# EasyEDA Pro project Custom_Stm_Board_v1.1.epro

# Schematic Schematic1
Board Name: Board1; Create Date: 2026-06-29; Page Name: P1; Project Name: Custom_stm_board; Schematic Name: Schematic1; Update Date: 2026-06-29; Company: EasyEDA.com; Page Size: A4; Version: V1.0
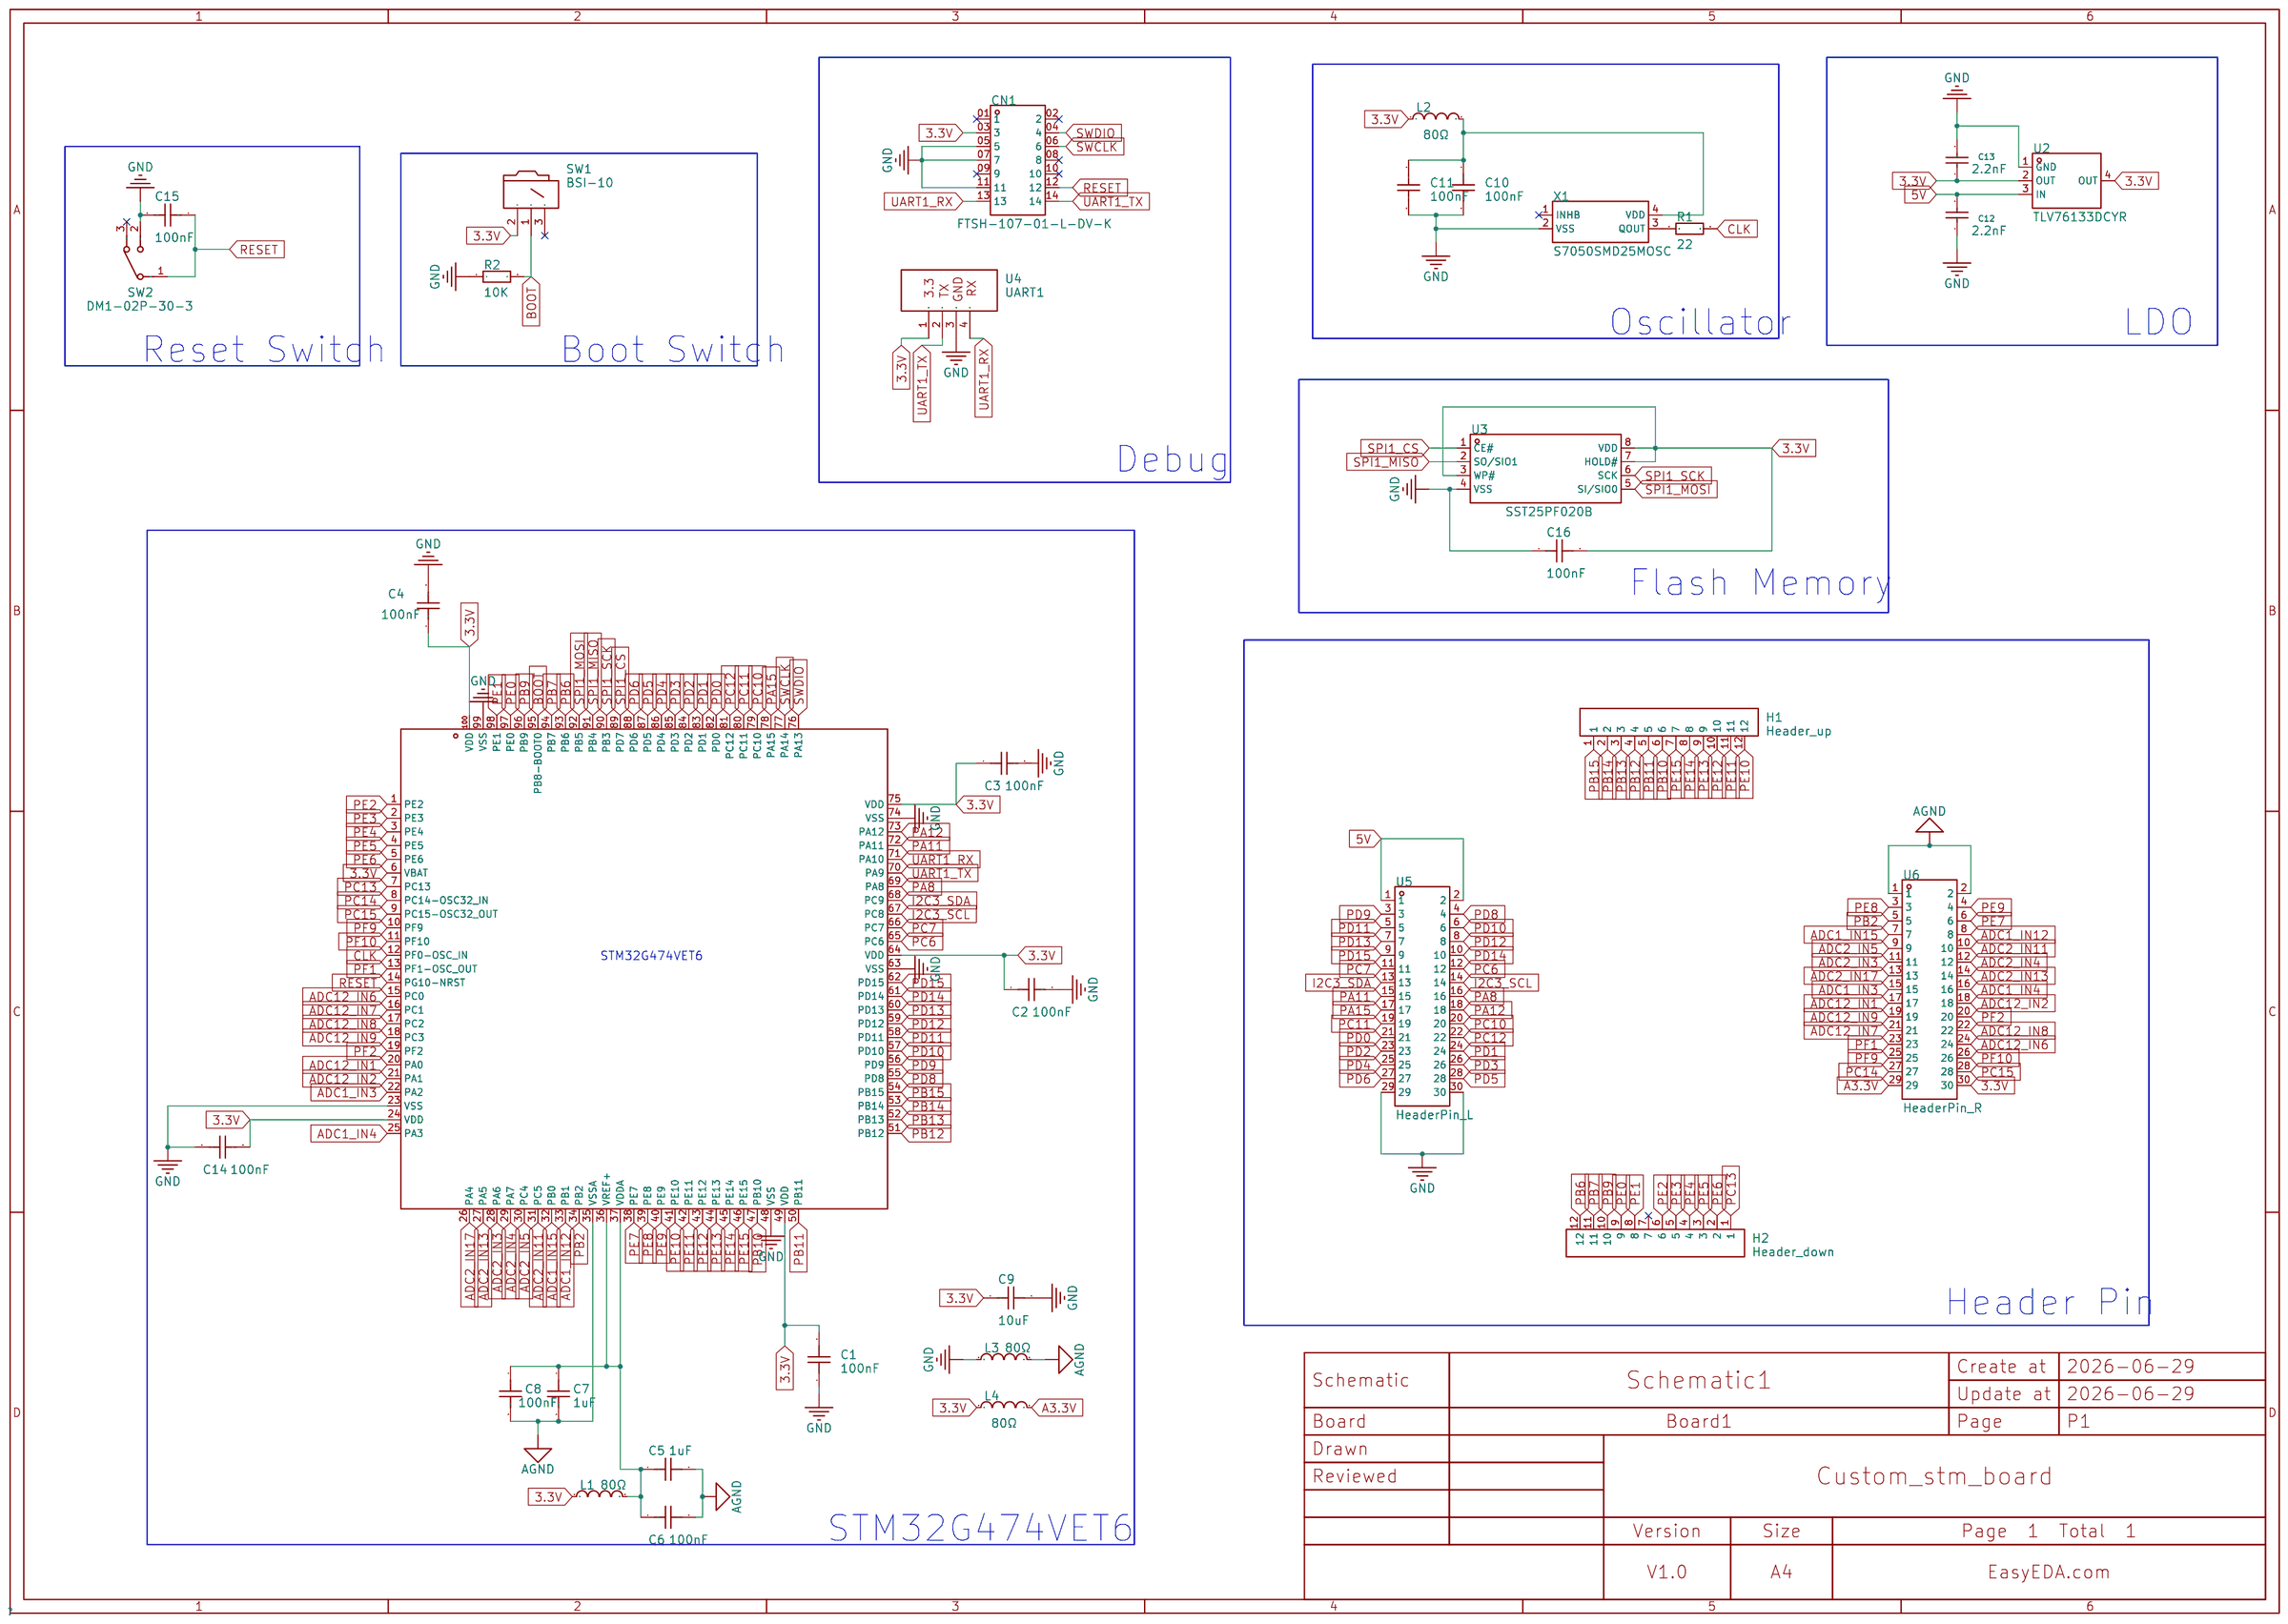
[diagram p0: schematic sheet]

## Parts
C1  100nF  [C0603]
C2  100nF  [C0603]
C3  100nF  [C0603]
C4  100nF  [C0603]
C5  1uF  [C0603]
C6  100nF  [C0603]
C7  1uF  [C0603]
C8  100nF  [C0603]
C9  10uF  [C0603]
C10  100nF  [C0603]
C11  100nF  [C0603]
C12  2.2nF  [C0805]
C13  2.2nF  [C0805]
C14  100nF  [C0603]
C15  100nF  [C0603]
C16  100nF  [C0603]
CN1  FTSH-107-01-L-DV-K  [HDR-SMD_14P-P1.27_FTSH-107-01-L-DV-K]
H1  Header_up  [HDR-TH_12P-P2.54-V-M]
H2  Header_down  [HDR-TH_12P-P2.54-V-M]
L1  80Ω  [L0603]
L2  80Ω  [L0603]
L3  80Ω  [L0603]
L4  80Ω  [L0603]
R1  22  [R0603]
R2  10K  [R0603]
SW1  BSI-10  [SW-TH_BSI-10]
SW2  DM1-02P-30-3  [SW-TH_3P-L12.8-W5.8-P5.08_DM1-02P-30-3]
U1  STM32G474VET6  [LQFP-100_L14.0-W14.0-P0.50-LS16.0-BL]
U2  TLV76133DCYR  [SOT-223-4_L6.5-W3.5-P2.30-LS7.0-TR]
U3  SST25PF020B  [SOIC-8_L4.9-W3.9-P1.27-LS6.0-BL]
U4  UART１  [DC_Main_to_Motordriver_Connector_L]
U5  HeaderPin_L  [HDR-TH_30P-P2.54-V-M-R2-C15-S2.54-BL]
U6  HeaderPin_R  [HDR-TH_30P-P2.54-V-M-R2-C15-S2.54-BL]
X1  S7050SMD25MOSC  [OSC-SMD_4P-L7.0-W5.0-BL-2]

## Library data of the parts
C1-C11 C14-C16 = CAP_0603: Supplier Footprint: 0603
C12 C13 = CL21B474KBFNNNE: Capacitance: Tolerance:±10% Tolerance:±10% Voltage Rated: Temperature Coefficient:; LCSC Part Name: 470nF ±10% 50V; Supplier Part: C13967; Manufacturer: SAMSUNG(三星); Supplier Footprint: 0805; JLCPCB Part Class: Basic Part; Datasheet: https://atta.szlcsc.com/upload/public/pdf/source/20160218/1457707763339.pdf; Supplier: LCSC; Tolerance: ±10%
CN1 = FTSH-107-01-L-DV-K: Pin Structure:2x7P Pitch:1.27mm Circluar Pins/Square Pins:Pin Header Mounting Type:Surface Mount,Vertical Number of Rows:2 Number of Pins:14P Length of Mating Pin:3.05mm Contact Material:Phosphor Bronze Contact Plating:Gold Operating Temperature:-55℃~+125; LCSC Part Name: 2x7P 间距:1.27mm 方针 立贴; Supplier Part: C5307809; Manufacturer: SAMTEC; Supplier Footprint: SMD,P=1.27mm; JLCPCB Part Class: Extended Part; Datasheet: https://item.szlcsc.com/datasheet/FTSH-107-01-L-DV-K/6061160.html; Supplier: LCSC; Pin Structure: 2x7P; Pitch: 1.27mm; Circluar Pins/Square Pins: Pin Header; Mounting Type: Surface Mount,Vertical; Number of Rows: 2; Number of Pins: 14P; Length of Mating Pin: 3.05mm; Contact Material: Phosphor Bronze; Contact Plating: Gold; Operating Temperature: -55℃~+125℃; Color: Black
H1 H2 = PZ254V-11-12P: Pin Structure:1x12P Pitch:2.54mm Row Spacing:- Circluar Pins/Square Pins:Pin Header Mounting Type:Through Hole Number of Rows:1 Number of Pins:12P Current Rating:3A Voltage Rating (Max):250V Length of Mating Pin:6mm Insulation Height:2.5mm Length of End C; LCSC Part Name: 1x12P 间距:2.54mm 方针 直插; Supplier Part: C2840012; Manufacturer: XFCN(兴飞); Supplier Footprint: 插件,P=2.54mm; JLCPCB Part Class: Extended Part; Datasheet: https://item.szlcsc.com/datasheet/PZ254V-11-12P/3017606.html; Supplier: LCSC; Pin Structure: 1x12P; Pitch: 2.54mm; Circluar Pins/Square Pins: Pin Header; Mounting Type: Through Hole; Number of Rows: 1; Number of Pins: 12P; Current Rating: 3A; Voltage Rating (Max): 250V; Length of Mating Pin: 6mm; Insulation Height: 2.5mm; Length of End Connection Pin: 3mm; Operating Temperature: -40℃~+105℃; Color: Black
L1 L3 = GZ1608D601TF: Impedance @ Frequency:600Ω@100MHz Tolerance:±25% Tolerance:±25% DC Resistance(DCR):450mΩ Current Rating:200mA Number of Circuits:1 Operating Temperature:-55℃~+125℃ Operating Temperature:-55℃~+125℃; LCSC Part Name: 单路 0603磁珠 阻抗600Ω@100MHz; Supplier Part: C1002; Manufacturer: Sunlord(顺络); Supplier Footprint: 0603; JLCPCB Part Class: Basic Part; Datasheet: https://item.szlcsc.com/datasheet/GZ1608D601TF/1354.html; Supplier: LCSC; Impedance @ Frequency: 600Ω@100MHz; Tolerance: ±25%; DC Resistance(DCR): 450mΩ; Current Rating: 200mA; Number of Circuits: 1; Operating Temperature: -55℃~+125℃
L2 L4 = L_0603
R1 R2 = Res_0603: Supplier Footprint: 0603
SW1 = BSI-10: Circuit:SPDT Actuator Style:- Termination Style:PC Pin Length:10mm Width:2.5mm Switch Height:6.4mm Mounting Type:Through Hole Actuator Color:Red Current Rating:500mA Voltage Rating:12V Life:1,000 Cycles Operating Temperature:-40℃~+85℃ Operating Temperatur; LCSC Part Name: 滑动开关; Supplier Part: C2985934; Manufacturer: SM Switch; Supplier Footprint: 插件,10x2.5mm; JLCPCB Part Class: Extended Part; Datasheet: https://item.szlcsc.com/datasheet/BSI-10/3431186.html; Supplier: LCSC; Circuit: SPDT; Termination Style: PC Pin; Length: 10mm; Width: 2.5mm; Switch Height: 6.4mm; Mounting Type: Through Hole; Actuator Color: Red; Current Rating: 500mA; Voltage Rating: 12V; Life: 1,000 Cycles; Operating Temperature: -40℃~+85℃
SW2 = DM1-02P-30-3: Circuit:SPDT Actuator Style:- Length:12.8mm Width:5.8mm Switch Height:6.7mm Current Rating (DC):50mA Voltage Rating (DC):125V Current Rating (AC):1A Voltage Rating (AC):125V Life:50,000 cycles Termination Style:PC Pin Operating Temperature:-25℃~+85℃ Opera; LCSC Part Name: 鼠标3脚微动 白点直柄13.5; Supplier Part: C431538; Manufacturer: SHOU HAN(首韩); Supplier Footprint: 插件,12.8x6.4mm; JLCPCB Part Class: Extended Part; Datasheet: https://item.szlcsc.com/datasheet/DM1-02P-30-3/427895.html; Supplier: LCSC; Circuit: SPDT; Length: 12.8mm; Width: 5.8mm; Switch Height: 6.7mm; Current Rating (DC): 50mA; Voltage Rating (DC): 125V; Current Rating (AC): 1A; Voltage Rating (AC): 125V; Life: 50,000 cycles; Termination Style: PC Pin; Operating Temperature: -25℃~+85℃
U1 = STM32G474VET6: CPU Core:ARM Cortex-M Series CPU Maximum Speed:170MHz Program Storage Size:512KB Program Memory Type:FLASH Number of I/O:86 ADC (Bit):12bit DAC (Bit):12bit Voltage - Supply:1.71V~3.6V Voltage - Supply:1.71V~3.6V Applications:-; LCSC Part Name: 带DSP和FPU的170MHz主流ARM Cortex-M4 MCU，具有512 KB Flash存储器、数学加速器、高分辨率定时器和高模拟电平集成; Supplier Part: C431632; Manufacturer: ST(意法半导体); Supplier Footprint: LQFP-100(14x14); JLCPCB Part Class: Extended Part; Datasheet: https://item.szlcsc.com/datasheet/STM32G474VET6/428110.html; Supplier: LCSC; CPU Core: ARM Cortex-M Series; CPU Maximum Speed: 170MHz; Program Storage Size: 512KB; Program Memory Type: FLASH; Number of I/O: 86; ADC (Bit): 12bit; DAC (Bit): 12bit; Voltage - Supply: 1.71V~3.6V
U2 = TLV76133DCYR: Output Type:Fixed Voltage - Supply:16V Output Voltage:3.3V Output Voltage:3.3V Output Current:1A Power Supply Rejection Ratio (PSRR):- standby current:- Noise:- Features:ESD Protection；Surge Protection；Low ESR；Over Temperature Protection；Under Voltage Loc; LCSC Part Name: 16V 1A 固定输出线性电压调节器; Supplier Part: C7527500; Manufacturer: TI(德州仪器); Supplier Footprint: SOT-223; JLCPCB Part Class: Extended Part; Datasheet: https://www.ti.com.cn/cn/lit/ds/symlink/tlv761.pdf?ts=1739383123903; Supplier: LCSC; Output Type: Fixed; Voltage - Supply: 16V; Output Voltage: 3.3V; Output Current: 1A; Features: ESD Protection；Surge Protection；Low ESR；Over Temperature Protection；Under Voltage Lockout；Over Current Protection；Enable；Reverse Current Protection; Operating Temperature: -40℃~+125℃@(Tj); Output Configuration: Positive; Number of Outputs: 1
U3 = SST25PF020B-80-4C-SAE-T: Interface Type:SPI Memory Size:2Mbit Clock Frequency (fc):80MHz Supply Voltage:2.3V~3.6V Supply Voltage:2.3V~3.6V Block Erase Time (tBE):18ms Data Retention - TDR (Year):100 years Operating Temperature:0℃~+70℃ Operating Temperature:0℃~+70℃; Supplier Part: C624745; Manufacturer: MICROCHIP(美国微芯); Supplier Footprint: SOIC-8; JLCPCB Part Class: Extended Part; Datasheet: https://atta.szlcsc.com/upload/public/pdf/source/20220621/33E3ED5F936835370EA58ECD5113757F.pdf; Supplier: LCSC; Interface Type: SPI; Memory Size: 2Mbit; Clock Frequency (fc): 80MHz; Supply Voltage: 2.3V~3.6V; Block Erase Time (tBE): 18ms; Data Retention - TDR (Year): 100 years; Operating Temperature: 0℃~+70℃
U4 = DC_Main_to_Motordriver_Connector
U5 U6 = PZ254V-12-30P: Pin Structure:2x15P Pitch:2.54mm Row Spacing:2.54mm Circluar Pins/Square Pins:Pin Header Mounting Type:Through Hole Number of Rows:2 Number of Pins:30P Current Rating:3A Length of Mating Pin:6.1mm Insulation Height:2.5mm Length of End Connection Pin:3mm C; LCSC Part Name: 2x15P 间距:2.54mm 方针 直插; Supplier Part: C22465939; Manufacturer: XFCN(兴飞); Supplier Footprint: 插件,P=2.54mm; JLCPCB Part Class: Extended Part; Datasheet: https://item.szlcsc.com/datasheet/PZ254V-12-30P/24163081.html; Supplier: LCSC; Pin Structure: 2x15P; Pitch: 2.54mm; Row Spacing: 2.54mm; Circluar Pins/Square Pins: Pin Header; Mounting Type: Through Hole; Number of Rows: 2; Number of Pins: 30P; Current Rating: 3A; Length of Mating Pin: 6.1mm; Insulation Height: 2.5mm; Length of End Connection Pin: 3mm; Contact Material: Brass; Operating Temperature: -40℃~+105℃; Color: Black
X1 = S7050SMD25MOSC: LCSC Part Name: 25MHz ±20ppm 1.8~5.0V; Supplier Part: C7431193; Manufacturer: SST(索斯特); Supplier Footprint: SMD7050-4P; Datasheet: https://item.szlcsc.com/datasheet/S7050SMD25MOSC/8432061.html; Supplier: LCSC

## Nets
3.3V: C1.2 C2.1 C3.1 C4.1 C9.1 C13.1 C14.2 C16.2 CN1.03(3) L1.1 L2.1 L4.1 SW1.2 U1.6(VBAT) U1.24(VDD) U1.49(VDD) U1.64(VDD) U1.75(VDD) U1.100(VDD) U2.2(OUT) U2.4(OUT) U3.3(WP#) U3.7(HOLD#) U3.8(VDD) U4.1 U6.30
5V: C12.2 U2.3(IN) U5.1 U5.2
A3.3V: L4.2 U6.29
AGND: C5.2 C6.2 C7.2 C8.2 L3.2 U1.35(VSSA) U6.1 U6.2
GND: C1.1 C2.2 C3.2 C4.2 C9.2 C10.2 C11.2 C12.1 C13.2 C14.1 C15.2 C16.1 CN1.05(5) CN1.07(7) CN1.11 L3.1 R2.1 SW2.2(ON) U1.23(VSS) U1.48(VSS) U1.63(VSS) U1.74(VSS) U1.99(VSS) U2.1(GND) U3.4(VSS) U4.3 U5.29 U5.30 X1.2(VSS)
ADC1_IN3: U1.22(PA2) U6.15
ADC1_IN4: U1.25(PA3) U6.16
ADC1_IN12: U1.33(PB1) U6.8
ADC1_IN15: U1.32(PB0) U6.7
ADC2_IN3: U1.28(PA6) U6.11
ADC2_IN4: U1.29(PA7) U6.12
ADC2_IN5: U1.30(PC4) U6.9
ADC2_IN11: U1.31(PC5) U6.10
ADC2_IN13: U1.27(PA5) U6.14
ADC2_IN17: U1.26(PA4) U6.13
ADC12_IN1: U1.20(PA0) U6.17
ADC12_IN2: U1.21(PA1) U6.18
ADC12_IN6: U1.15(PC0) U6.24
ADC12_IN7: U1.16(PC1) U6.21
ADC12_IN8: U1.17(PC2) U6.22
ADC12_IN9: U1.18(PC3) U6.19
BOOT: R2.2 SW1.1 U1.95(PB8-BOOT0)
CLK: R1.2 U1.12(PF0-OSC_IN)
I2C3_SCL: U1.67(PC8) U5.14
I2C3_SDA: U1.68(PC9) U5.13
PA8: U1.69(PA8) U5.16
PA11: U1.72(PA11) U5.15
PA12: U1.73(PA12) U5.18
PA15: U1.78(PA15) U5.17
PB2: U1.34(PB2) U6.5
PB6: H2.12 U1.93(PB6)
PB7: H2.11 U1.94(PB7)
PB9: H2.10 U1.96(PB9)
PB10: H1.6 U1.47(PB10)
PB11: H1.5 U1.50(PB11)
PB12: H1.4 U1.51(PB12)
PB13: H1.3 U1.52(PB13)
PB14: H1.2 U1.53(PB14)
PB15: H1.1 U1.54(PB15)
PC6: U1.65(PC6) U5.12
PC7: U1.66(PC7) U5.11
PC10: U1.79(PC10) U5.20
PC11: U1.80(PC11) U5.19
PC12: U1.81(PC12) U5.22
PC13: H2.1 U1.7(PC13)
PC14: U1.8(PC14-OSC32_IN) U6.27
PC15: U1.9(PC15-OSC32_OUT) U6.28
PD0: U1.82(PD0) U5.21
PD1: U1.83(PD1) U5.24
PD2: U1.84(PD2) U5.23
PD3: U1.85(PD3) U5.26
PD4: U1.86(PD4) U5.25
PD5: U1.87(PD5) U5.28
PD6: U1.88(PD6) U5.27
PD8: U1.55(PD8) U5.4
PD9: U1.56(PD9) U5.3
PD10: U1.57(PD10) U5.6
PD11: U1.58(PD11) U5.5
PD12: U1.59(PD12) U5.8
PD13: U1.60(PD13) U5.7
PD14: U1.61(PD14) U5.10
PD15: U1.62(PD15) U5.9
PE0: H2.9 U1.97(PE0)
PE1: H2.8 U1.98(PE1)
PE2: H2.6 U1.1(PE2)
PE3: H2.5 U1.2(PE3)
PE4: H2.4 U1.3(PE4)
PE5: H2.3 U1.4(PE5)
PE6: H2.2 U1.5(PE6)
PE7: U1.38(PE7) U6.6
PE8: U1.39(PE8) U6.3
PE9: U1.40(PE9) U6.4
PE10: H1.12 U1.41(PE10)
PE11: H1.11 U1.42(PE11)
PE12: H1.10 U1.43(PE12)
PE13: H1.9 U1.44(PE13)
PE14: H1.8 U1.45(PE14)
PE15: H1.7 U1.46(PE15)
PF1: U1.13(PF1-OSC_OUT) U6.23
PF2: U1.19(PF2) U6.20
PF9: U1.10(PF9) U6.25
PF10: U1.11(PF10) U6.26
RESET: C15.1 CN1.12 SW2.1(COM) U1.14(PG10-NRST)
SPI1_CS: U1.89(PD7) U3.1(CE#)
SPI1_MISO: U1.91(PB4) U3.2(SO/SIO1)
SPI1_MOSI: U1.92(PB5) U3.5(SI/SIO0)
SPI1_SCK: U1.90(PB3) U3.6(SCK)
SWCLK: CN1.06(6) U1.77(PA14)
SWDIO: CN1.04(4) U1.76(PA13)
UART1_RX: CN1.13 U1.71(PA10) U4.4
UART1_TX: CN1.14 U1.70(PA9) U4.2
$1N21: C5.1 C6.1 C7.1 C8.1 L1.2 U1.36(VREF+) U1.37(VDDA)
$1N29: R1.1 X1.3(QOUT)
$1N30: C10.1 C11.1 L2.2 X1.4(VDD)

Not connected (* = marked no-connect by the designer): CN1 01(1)* 02(2)* 08(8)* 09(9)* 10*; H2 7*; SW1 3*; SW2 3(NC)*; X1 1(INHB)*

## Notes on the sheet
- Oscillator
- LDO
- Reset Switch
- Boot Switch
- Debug
- Flash Memory
- STM32G474VET6
- Header Pin
- STM32G474VET6

# Board PCB1
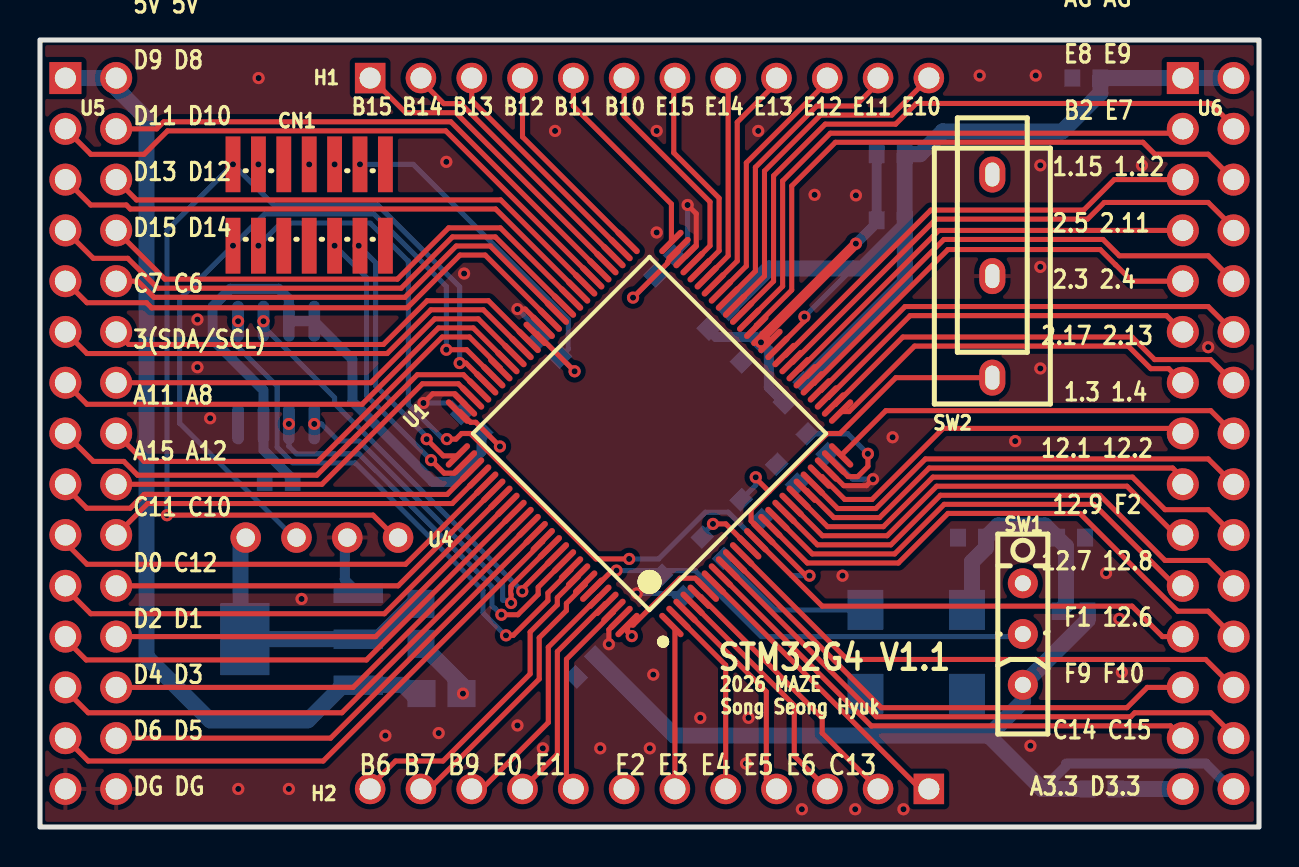
[diagram p1: board, top side]
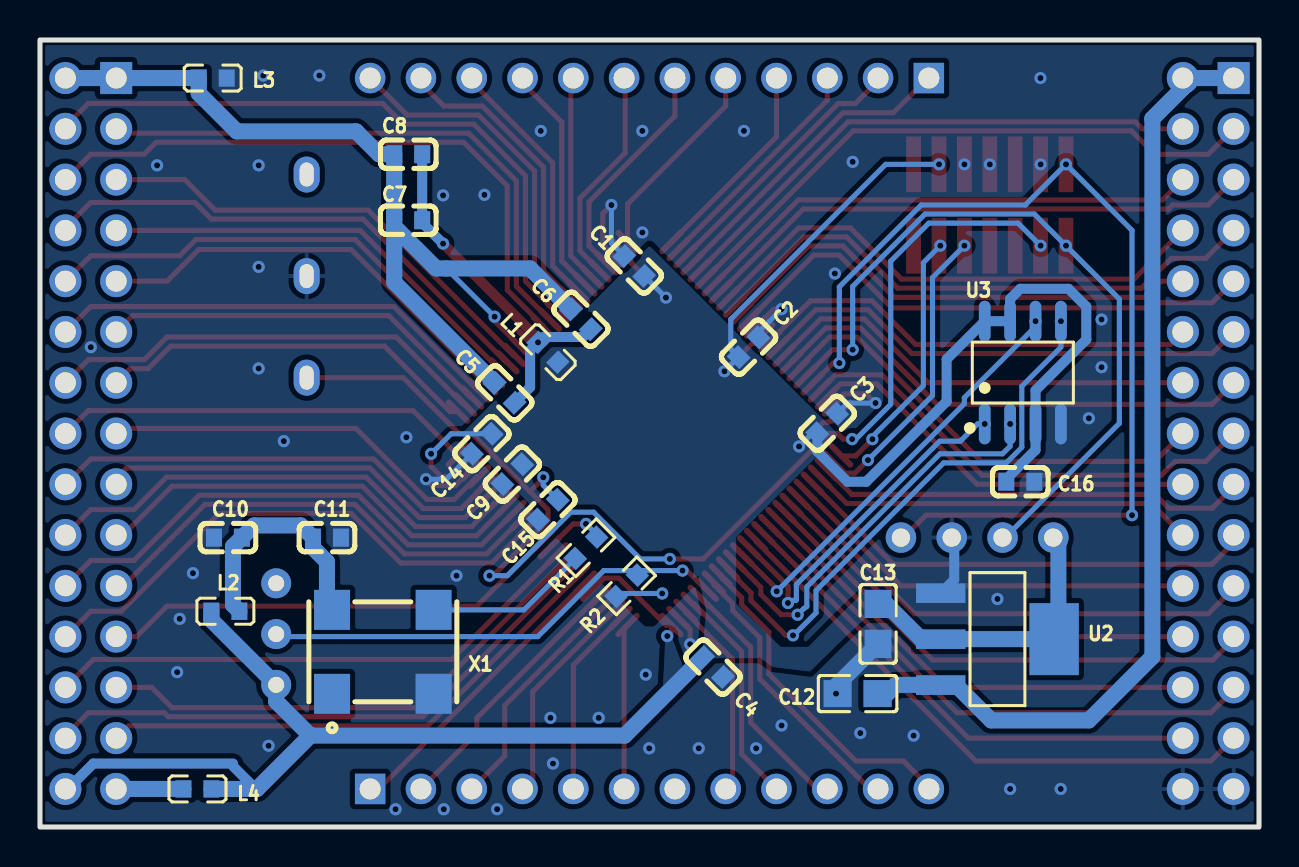
[diagram p2: board, bottom side, seen from below]

Outline 60.96 x 39.37 mm; copper layers: Top Layer, Bottom Layer. Coordinates in mm from the lower left corner of the outline.
Outline path: rectangle 0,39.37 60.96,0
Stack: Top Layer 0.035mm / Dielectric1 1.51mm FR4 er 4.5 / Bottom Layer 0.035mm

## Design rules (mm)
spacing copperThickness1oz (default): track to track 0.2, other pairs 0.152 to 0.3
spacing copperThickness2oz: track to track 0.203, other pairs 0.152 to 0.3
track width copperThickness1oz (default): min 0.127, default 0.254, max 2.54
track width copperThickness2oz: min 0.203, default 0.254, max 2.54
differential pair differentialPair (default): width min 0.127, default 0.254, max 2.54; gap min 0.152, default 0.152
net 3.3V uses copperRegion
net GND uses copperRegion

## Placement (name value [footprint] x y rotation side)
C1  100nF  [C0603]  31.24 28.07 225 bottom
C2  100nF  [C0603]  25.53 24 135 bottom
C3  100nF  [C0603]  21.59 20.19 135 bottom
C4  100nF  [C0603]  27.3 8 225 bottom
C5  1uF  [C0603]  37.72 21.72 45 bottom
C6  100nF  [C0603]  33.91 25.4 45 bottom
C7  1uF  [C0603]  42.55 30.35 0 bottom
C8  100nF  [C0603]  42.55 33.66 0 bottom
C9  10uF  [C0603]  37.34 17.65 315 bottom
C10  100nF  [C0603]  51.56 14.48 0 bottom
C11  100nF  [C0603]  46.61 14.48 180 bottom
C12  2.2nF  [C0805]  20.07 6.67 180 bottom
C13  2.2nF  [C0805]  19.05 10.16 270 bottom
C14  100nF  [C0603]  38.86 19.18 135 bottom
C15  100nF  [C0603]  35.56 15.88 315 bottom
C16  100nF  [C0603]  11.94 17.27 0 bottom
CN1  FTSH-107-01-L-DV-K  [HDR-SMD_14P-P1.27_FTSH-107-01-L-DV-K]  13.46 31.12 180 top
H1  Header_up  [HDR-TH_12P-P2.54-V-M]  30.48 37.47 0 top
H2  Header_down  [HDR-TH_12P-P2.54-V-M]  30.48 1.91 180 top
L1  80Ω  [L0603]  35.56 23.75 45 bottom
L2  80Ω  [L0603]  51.69 10.8 180 bottom
L3  80Ω  [L0603]  52.32 37.47 0 bottom
L4  80Ω  [L0603]  53.09 1.91 0 bottom
R1  22  [R0603]  33.66 13.97 135 bottom
R2  10K  [R0603]  31.62 12.06 135 bottom
SW1  BSI-10  [SW-TH_BSI-10]  49.15 9.65 90 top
SW2  DM1-02P-30-3  [SW-TH_3P-L12.8-W5.8-P5.08_DM1-02P-30-3]  47.63 27.56 90 top
U1  STM32G474VET6  [LQFP-100_L14.0-W14.0-P0.50-LS16.0-BL]  30.48 19.69 45 top
U2  TLV76133DCYR  [SOT-223-4_L6.5-W3.5-P2.30-LS7.0-TR]  13.08 9.4 270 bottom
U3  SST25PF020B  [SOIC-8_L4.9-W3.9-P1.27-LS6.0-BL]  11.81 22.73 180 bottom
U4  UART１  [DC_Main_to_Motordriver_Connector_L]  14.1 14.48 90 top
U5  HeaderPin_L  [HDR-TH_30P-P2.54-V-M-R2-C15-S2.54-BL]  2.54 19.69 270 top
U6  HeaderPin_R  [HDR-TH_30P-P2.54-V-M-R2-C15-S2.54-BL]  58.42 19.69 270 top
X1  S7050SMD25MOSC  [OSC-SMD_4P-L7.0-W5.0-BL-2]  43.82 8.76 180 bottom

## Footprints (pads in the part's own frame, mm; a bottom-side part is the same pattern mirrored in y, then rotated)
C0603
  rect 0.8x0.9 smd: 1(-0.7,0) 2(0.7,0)
C0805
  rect 1.41x1.35 smd: 1(-1,0) 2(1,0)
DC_Main_to_Motordriver_Connector_L
  round 1.524 hole 0.914: 0(0,3.81) 1(0,1.27) 2(0,-1.27) 3(0,-3.81)
HDR-SMD_14P-P1.27_FTSH-107-01-L-DV-K
  rect 0.74x2.79 smd: 01(-3.81,-2.035) 02(-3.81,2.035) 03(-2.54,-2.035) 04(-2.54,2.035) 05(-1.27,-2.035) 06(-1.27,2.035) 07(0,-2.035) 08(0,2.035) 09(1.27,-2.035) 10(1.27,2.035) 11(2.54,-2.035) 12(2.54,2.035) 13(3.81,-2.035) 14(3.81,2.035)
HDR-TH_12P-P2.54-V-M
  rect 1.524x1.524 hole 1.05: 1(-13.97,0)
  round 1.524 hole 1.05: 2(-11.43,0) 3(-8.89,0) 4(-6.35,0) 5(-3.81,0) 6(-1.27,0) 7(1.27,0) 8(3.81,0) 9(6.35,0) 10(8.89,0) 11(11.43,0) 12(13.97,0)
HDR-TH_30P-P2.54-V-M-R2-C15-S2.54-BL
  rect 1.6x1.6 hole 1.05: 1(-17.78,-1.27)
  round 1.6 hole 1.05: 2(-17.78,1.27) 3(-15.24,-1.27) 4(-15.24,1.27) 5(-12.7,-1.27) 6(-12.7,1.27) 7(-10.16,-1.27) 8(-10.16,1.27) 9(-7.62,-1.27) 10(-7.62,1.27) 11(-5.08,-1.27) 12(-5.08,1.27) 13(-2.54,-1.27) 14(-2.54,1.27) 15(0,-1.27) 16(0,1.27) 17(2.54,-1.27) 18(2.54,1.27) 19(5.08,-1.27) 20(5.08,1.27) 21(7.62,-1.27) 22(7.62,1.27) 23(10.16,-1.27) 24(10.16,1.27) 25(12.7,-1.27) 26(12.7,1.27) 27(15.24,-1.27) 28(15.24,1.27) 29(17.78,-1.27) 30(17.78,1.27)
L0603
  rect 0.8x0.864 smd: 1(-0.7,0) 2(0.7,0)
LQFP-100_L14.0-W14.0-P0.50-LS16.0-BL
  oval 0.3x1.6 smd: 1(-6,-7.55) 2(-5.5,-7.55) 3(-5,-7.55) 4(-4.5,-7.55) 5(-4,-7.55) 6(-3.5,-7.55) 7(-3,-7.55) 8(-2.5,-7.55) 9(-2,-7.55) 10(-1.5,-7.55) 11(-1,-7.55) 12(-0.5,-7.55) 13(0,-7.55) 14(0.5,-7.55) 15(1,-7.55) 16(1.5,-7.55) 17(2,-7.55) 18(2.5,-7.55) 19(3,-7.55) 20(3.5,-7.55) 21(4,-7.55) 22(4.5,-7.55) 23(5,-7.55) 24(5.5,-7.55) 25(6,-7.55) 51(6,7.55) 52(5.5,7.55) 53(5,7.55) 54(4.5,7.55) 55(4,7.55) 56(3.5,7.55) 57(3,7.55) 58(2.5,7.55) 59(2,7.55) 60(1.5,7.55) 61(1,7.55) 62(0.5,7.55) 63(0,7.55) 64(-0.5,7.55) 65(-1,7.55) 66(-1.5,7.55) 67(-2,7.55) 68(-2.5,7.55) 69(-3,7.55) 70(-3.5,7.55) 71(-4,7.55) 72(-4.5,7.55) 73(-5,7.55) 74(-5.5,7.55) 75(-6,7.55)
  oval 1.6x0.3 smd: 26(7.55,-6) 27(7.55,-5.5) 28(7.55,-5) 29(7.55,-4.5) 30(7.55,-4) 31(7.55,-3.5) 32(7.55,-3) 33(7.55,-2.5) 34(7.55,-2) 35(7.55,-1.5) 36(7.55,-1) 37(7.55,-0.5) 38(7.55,0) 39(7.55,0.5) 40(7.55,1) 41(7.55,1.5) 42(7.55,2) 43(7.55,2.5) 44(7.55,3) 45(7.55,3.5) 46(7.55,4) 47(7.55,4.5) 48(7.55,5) 49(7.55,5.5) 50(7.55,6) 76(-7.55,6) 77(-7.55,5.5) 78(-7.55,5) 79(-7.55,4.5) 80(-7.55,4) 81(-7.55,3.5) 82(-7.55,3) 83(-7.55,2.5) 84(-7.55,2) 85(-7.55,1.5) 86(-7.55,1) 87(-7.55,0.5) 88(-7.55,0) 89(-7.55,-0.5) 90(-7.55,-1) 91(-7.55,-1.5) 92(-7.55,-2) 93(-7.55,-2.5) 94(-7.55,-3) 95(-7.55,-3.5) 96(-7.55,-4) 97(-7.55,-4.5) 98(-7.55,-5) 99(-7.55,-5.5) 100(-7.55,-6)
OSC-SMD_4P-L7.0-W5.0-BL-2
  rect 1.8x2 smd: 1(-2.54,-2.1) 2(2.54,-2.1) 3(2.54,2.1) 4(-2.54,2.1)
R0603
  rect 0.806x0.864 smd: 1(-0.753,0) 2(0.753,0)
SOIC-8_L4.9-W3.9-P1.27-LS6.0-BL
  oval 0.588x2.045 smd: 1(-1.905,-2.57) 2(-0.635,-2.57) 3(0.635,-2.57) 4(1.905,-2.57) 5(1.905,2.57) 6(0.635,2.57) 7(-0.635,2.57) 8(-1.905,2.57)
SOT-223-4_L6.5-W3.5-P2.30-LS7.0-TR
  rect 0.98x2.47 smd: 1(-2.3,-2.835) 2(0,-2.835) 3(2.3,-2.835)
  rect 3.6x2.47 smd: 4(0,2.835)
SW-TH_3P-L12.8-W5.8-P5.08_DM1-02P-30-3
  oval 1.8x1.3 hole 1.2x0.7: 1(-5.08,0) 2(0,0) 3(5.08,0)
SW-TH_BSI-10
  round 1.5 hole 0.8: 1(0,0) 2(-2.54,0) 3(2.54,0)

## Nets
As in the schematic, except:
3.3V: C1.2 C2.1 C3.1 C4.1 C9.1 C13.1 C14.2 C16.2 CN1.03 L1.1 L2.1 L4.1 SW1.2 U1.6 U1.24 U1.49 U1.64 U1.75 U1.100 U2.2 U2.4 U3.3 U3.7 U3.8 U4.0 U6.30
GND: C1.1 C2.2 C3.2 C4.2 C9.2 C10.2 C11.2 C12.1 C13.2 C14.1 C15.2 C16.1 CN1.05 CN1.07 CN1.11 L3.1 R2.1 SW2.2 U1.23 U1.48 U1.63 U1.74 U1.99 U2.1 U3.4 U4.2 U5.29 U5.30 X1.2
UART1_RX: CN1.13 U1.71 U4.3
UART1_TX: CN1.14 U1.70 U4.1

Pads without a net: CN1 01 02 08 09 10; H2 7; SW1 3; SW2 3; X1 1

## Via types
v1: diameter 0.61, hole 0.305, Top Layer to Bottom Layer, 85 vias

## Routing (per net, layer and track width the routed paths; a pad name or vN(x,y) marks a point on that pad's centre or on a via; arc(x,y) is an arc through that point)
3.3V: length 132.8
  Top Layer w0.254: v1(29.66,26.48) 31.39,28.22 31.39,28.28 31.93,28.81 U1.49 ; v1(29.59,9.55) 29.38,9.76 29.38,10.1 29.66,10.1 32,12.45 32.77,12.45 U1.6 ; v1(26.73,22.8) 24.86,24.67 24.79,24.67 ; 20.9,20.78 21,20.78 21.53,20.25 21.79,20.25 v1(23,19.04) ; U1.24 40.41,17.53 40.89,17.53 41.4,18.04 v1(41.4,18.67)
  Bottom Layer w0.254: 21.96,19.83 22.21,19.83 v1(23,19.04) ; C1.2 v1(29.66,26.48) ; v1(26.73,22.8) C2.1 26.42,23.9 26.42,25.4 18.67,33.15 v1(16,33.15) ; v1(41.4,18.67) 40.4,19.67 38.37,19.67
  Bottom Layer w0.5: 51.31,3.05 50.11,1.84 ; 51.31,3.17 58.29,3.17 59.69,1.78 ; 12.51,17.53 11.18,18.86 U3.3 11.18,21.84 8.64,24.38 8.64,26.03 9.52,26.92 11.94,26.92 12.45,26.42 U3.7 U3.8 15.62,23.4 15.62,21.29 19.64,17.27 20.57,17.27 22.08,18.78 22.08,19.7 ; 50.11,1.84 50.11,1.97 ; 50.11,1.84 50.11,1.78
  Bottom Layer w0.8: 10.16,14.48 10.03,14.35 10.03,9.4 U2.2 16.89,9.4 18.65,11.16 C13.1 ; 28.17,8.13 31.72,4.57 47.44,4.57 ; 47.44,4.57 50.11,1.91 L4.1 ; 47.44,4.57 49.15,6.28 49.15,7.11 52.39,10.35 L2.1
5V: length 48.1
  Bottom Layer w0.8: C12.2 18.6,6.67 18.16,7.11 15.17,7.11 ; 15.15,7.1 13.39,5.33 8.51,5.33 5.33,8.51 5.33,35.43 3.81,36.96 U5.2 U5.1
A3.3V: length 3.4
  Bottom Layer w0.8: L4.2 U6.29
AGND: length 47.8
  Top Layer w0.254: U1.35 38.23,25.31 v1(38.23,25.53)
  Bottom Layer w0.254: v1(38.23,25.53) 40.64,27.94
  Bottom Layer w0.8: 38.21,22.21 43.24,27.24 43.24,30.04 41.15,27.94 36.45,27.94 C6.2 ; C7.2 C8.2 44.01,33.66 45.15,34.8 51.12,34.8 53.02,36.7 L3.2 U6.1 U6.2
GND: length 29.9
  Top Layer w0.254: v1(19.18,21.21) 19.64,21.67 20.75,21.67 21.27,21.15 ; U1.99 28.45,9.87 v1(28.45,9.14) ; v1(41.66,17.4) 41.33,17.08 40.2,17.08 39.37,17.9 ; v1(32.39,31.12) 32.82,30.68 32.82,29.06 32.3,28.54 ; v1(23.88,25.91) 24.26,25.91 25.14,25.03
  Bottom Layer w0.254: v1(32.39,31.12) 32.39,29.21 C1.1 ; v1(41.66,17.4) 40.64,17.4 39.36,18.68 ; v1(23.88,25.91) 25.03,24.75 C2.2 ; v1(29.85,11.68) 32,11.68 R2.1 ; v1(19.18,21.21) 20.57,21.21 21.1,20.69
  Bottom Layer w0.5: 15.24,14.48 15.24,12.37 U2.1
  Bottom Layer w0.8: v1(21.15,6.67) 21.15,7.06 C13.2
  vias: v1(7.87,25.39) v1(7.87,23) v1(8.51,20.45) v1(9.92,1.91) v1(10.92,33.15) v1(10.93,37.47) v1(12.45,1.91) v1(13.08,11.41) v1(13.46,33.15) v1(14.73,33.15) v1(17.27,4.57) v1(19.94,4.7) v1(20.32,33.27) v1(21.21,27.69) v1(23.88,5.08) v1(25.15,3.94) v1(25.76,34.82) v1(28.02,3.94) v1(30.49,3.94) v1(30.67,7.62) v1(30.84,34.82) v1(30.84,29.74) v1(33.02,5.46) v1(35.31,3.17) v1(35.43,5.46) v1(35.92,34.82) v1(38.1,0.89) v1(38.73,31.62) v1(40.13,12.57) v1(40.8,31.6) v1(40.77,0.89) v1(42.64,19.5) v1(43.18,0.89) v1(46.99,37.59) v1(48.77,19.3) v1(49.53,4.06) v1(49.79,37.59) v1(50.02,33.1) v1(50.02,28.02) v1(50.02,22.94) v1(53.31,12.7) v1(53.98,10.41) v1(54.1,7.75) v1(55.1,33.1) v1(58.42,24)
ADC1_IN3: length 20.2
  Top Layer w0.254: U6.15 56.9,19.94 45.16,19.94 41.61,16.39 40.24,16.39 39.1,17.53 U1.22
ADC1_IN4: length 21
  Top Layer w0.254: 40.06,18.59 42.3,20.83 58.55,20.83 U6.16
ADC1_IN12: length 26.1
  Top Layer w0.254: U6.8 59.69,29.97 58.42,31.24 53.22,31.24 52.39,30.41 44.8,30.41 37.65,23.26 U1.33
ADC1_IN15: length 22.1
  Top Layer w0.254: U1.32 38.01,22.9 44.95,29.84 U6.7
ADC2_IN3: length 19.8
  Top Layer w0.254: U6.11 56.33,25.58 43.51,25.58 39.42,21.49 U1.28
ADC2_IN4: length 23
  Top Layer w0.254: U6.12 58.42,26.03 43.26,26.03 39.07,21.84 U1.29
ADC2_IN5: length 21.9
  Top Layer w0.254: U6.9 54.61,27.31 53.79,28.12 53.79,28.12 53.02,28.89 45.4,28.89 38.71,22.2 U1.30
ADC2_IN11: length 25.1
  Top Layer w0.254: U1.31 38.36,22.55 45.2,29.39 53.16,29.39 53.98,28.58 58.42,28.58 U6.10
ADC2_IN13: length 22.3
  Top Layer w0.254: U6.14 58.53,23.38 55.74,23.38 54.61,24.51 43.15,24.51 39.77,21.13 U1.27
ADC2_IN17: length 19.2
  Top Layer w0.254: U6.13 56.45,22.93 55.55,22.93 54.42,24.06 43.73,24.06 40.46,20.78 40.06,20.78
ADC12_IN1: length 21
  Top Layer w0.254: U1.20 38.36,16.82 39.7,15.48 41.99,15.48 44.47,17.96 56.64,17.96 57.15,17.45 U6.17
ADC12_IN2: length 23.1
  Top Layer w0.254: U6.18 58.42,18.41 44.28,18.41 41.8,15.93 39.89,15.93 U1.21
ADC12_IN6: length 27.5
  Top Layer w0.254: U6.24 58.42,10.8 56.89,10.8 52,15.69 45.41,15.69 42.93,13.21 38.37,13.21 U1.15
ADC12_IN7: length 23.7
  Top Layer w0.254: U6.21 56.78,12.06 52.7,16.14 45.22,16.14 42.74,13.66 38.62,13.66 U1.16
ADC12_IN8: length 26
  Top Layer w0.254: U1.17 38.88,14.12 42.55,14.12 45.03,16.6 53,16.6 56.26,13.34 58.42,13.34 U6.22
ADC12_IN9: length 22.2
  Top Layer w0.254: U6.19 56.8,14.61 54.36,17.05 44.84,17.05 42.36,14.57 39.13,14.57 U1.18
BOOT: length 23.5
  Top Layer w0.254: 27.63,11.85 28.61,12.83 v1(28.83,12.83)
  Bottom Layer w0.254: v1(28.83,12.83) 30.86,12.83 R2.2 31.32,12.83 32.77,12.83 36.07,9.53 49.02,9.53 SW1.1
CLK: length 3.2
  Top Layer w0.254: v1(33.65,15.16) 34.3,15.16 35.47,13.99
  Bottom Layer w0.254: R1.2 33.12,14.63 v1(33.65,15.16)
I2C3_SCL: length 22
  Top Layer w0.254: U1.67 21.92,25.42 19.74,25.42 16.54,22.23 U5.14
I2C3_SDA: length 24.8
  Top Layer w0.254: U1.68 21.66,24.97 19.92,24.97 16.11,21.15 2.35,21.15 U5.13
PA8: length 23.1
  Top Layer w0.254: U5.16 5.21,18.29 13.89,18.29 20.11,24.51 21.48,24.51 23.02,22.97 U1.69
PA11: length 24
  Top Layer w0.254: U1.72 21.18,22.62 18.87,22.62 13.84,17.6 4.88,17.6 4.19,18.29 2.67,18.29 U5.15
PA12: length 20.2
  Top Layer w0.254: U1.73 20.92,22.17 19.12,22.17 14.1,17.14 U5.18
PA15: length 21.7
  Top Layer w0.254: U1.78 20.36,16.64 5.2,16.64 4.51,15.95 2.34,15.95 1.27,17.02 U5.17
PB2: length 23.6
  Top Layer w0.254: U6.5 53.72,32.39 52.2,30.86 44.55,30.86 37.3,23.61 U1.34
PB6: length 16.4
  Top Layer w0.254: H2.12 16.51,2.03 17.78,3.3 20.16,3.3 24.51,7.66 24.51,9.76 25.87,11.11 25.87,11.47 26.91,12.51 U1.93
PB7: length 14
  Top Layer w0.254: U1.94 27.26,12.12 26.32,11.19 26.32,10.83 24.97,9.47 24.97,7.4 19.47,1.91 H2.11
PB9: length 12.6
  Top Layer w0.254: U1.96 27.94,11.52 25.42,9 25.42,5.23 22.1,1.91 H2.10
PB10: length 11.4
  Top Layer w0.254: H1.6 29.21,35.57 33.51,31.27 33.51,29.08 U1.47
PB11: length 10.2
  Top Layer w0.254: 31.58,29.27 31.58,31.16 26.67,36.07 H1.5
PB12: length 10.4
  Top Layer w0.254: H1.4 24.13,34.52 29.38,29.27
PB13: length 11.6
  Top Layer w0.254: H1.3 21.59,36.35 U1.52
PB14: length 13.4
  Top Layer w0.254: U1.53 21.05,36.19 20.19,36.19 19.05,37.33 H1.2
PB15: length 15.6
  Top Layer w0.254: U1.54 20.8,35.73 18.29,35.73 16.55,37.47 H1.1
PC6: length 22.6
  Top Layer w0.254: U1.65 22.42,26.33 19.36,26.33 17.17,24.14 4.44,24.14 U5.12
PC7: length 25
  Top Layer w0.254: U1.66 22.17,25.87 19.55,25.87 17.36,23.69 2.35,23.69 U5.11
PC10: length 19.4
  Top Layer w0.254: U5.20 5.39,16.18 20.61,16.18 U1.79
PC11: length 23.5
  Top Layer w0.254: U5.19 1.27,14.22 2.35,13.14 18.28,13.14 U1.80
PC12: length 20.8
  Top Layer w0.254: U5.22 17.91,12.06 U1.81
PC13: length 15
  Top Layer w0.254: H2.1 44.02,1.91 U1.7
PC14: length 26.5
  Top Layer w0.254: U6.27 56.53,5.06 41.57,5.06 U1.8
PC15: length 29
  Top Layer w0.254: U1.9 41.82,5.52 54.54,5.52 54.74,5.72 58.55,5.72 59.69,4.57 U6.28
PD0: length 24.8
  Top Layer w0.254: U1.82 17.22,10.67 2.54,10.67 1.27,11.94 U5.21
PD1: length 22.3
  Top Layer w0.254: U5.24 16.78,9.53 U1.83
PD2: length 26.1
  Top Layer w0.254: U5.23 1.27,9.4 2.31,8.36 16.32,8.36 U1.84
PD3: length 23.8
  Top Layer w0.254: U1.85 15.66,6.98 U5.26
PD4: length 27.6
  Top Layer w0.254: U1.86 15.1,5.72 2.41,5.72 1.27,6.86 U5.25
PD5: length 25.2
  Top Layer w0.254: U5.28 14.53,4.45 24.79,14.7
PD6: length 29
  Top Layer w0.254: U1.88 25.14,14.28 14.16,3.3 2.41,3.3 U5.27
PD8: length 27.4
  Top Layer w0.254: U5.4 5.84,34.92 6.19,35.28 20.54,35.28 U1.55
PD9: length 30.4
  Top Layer w0.254: U5.3 2.54,33.65 5.2,33.65 6.38,34.82 20.29,34.82 U1.56
PD10: length 25.6
  Top Layer w0.254: U1.57 23.04,31.37 4.83,31.37 U5.6
PD11: length 28
  Top Layer w0.254: U5.5 2.54,31.12 4.32,31.12 4.52,30.92 22.79,30.92 U1.58
PD12: length 26.3
  Top Layer w0.254: U1.59 23.02,29.97 20.44,29.97 17.87,27.41 6.25,27.41 U5.8
PD13: length 28.6
  Top Layer w0.254: U5.7 2.67,28.45 4.39,28.45 5.89,26.95 18.06,26.95 20.63,29.52 22.77,29.52 U1.60
PD14: length 24.8
  Top Layer w0.254: U1.61 22.52,29.06 20.81,29.06 18.25,26.5 5.7,26.5 4.89,27.31 U5.10
PD15: length 27.2
  Top Layer w0.254: 25.49,25.38 22.26,28.61 21,28.61 18.36,25.97 5.58,25.97 5.33,26.23 2.35,26.23 U5.9
PE0: length 11
  Top Layer w0.254: U1.97 28.26,11.16 25.87,8.78 25.87,3.65 H2.9
PE1: length 10
  Top Layer w0.254: H2.8 26.33,2.25 26.33,8.4 28.68,10.75 U1.98
PE2: length 8.3
  Top Layer w0.254: 31.58,10.1 31.75,9.93 H2.6
PE3: length 9.5
  Top Layer w0.254: U1.2 34.29,8.1 H2.5
PE4: length 10.8
  Top Layer w0.254: H2.4 36.32,2.41 36.32,6.77 U1.3
PE5: length 12
  Top Layer w0.254: H2.3 37.72,3.56 37.72,6.08 U1.4
PE6: length 13.3
  Top Layer w0.254: U1.5 33.05,11.52 39.12,5.46 39.12,4.7 H2.2
PE7: length 31.6
  Top Layer w0.254: U1.38 35.82,25.09 37.59,26.86 37.59,32.07 39.78,34.25 55.16,34.25 55.75,33.66 58.42,33.66 U6.6
PE8: length 28.7
  Top Layer w0.254: 35.47,25.38 37.14,27.05 37.14,32.32 39.52,34.71 56.93,34.71 U6.3
PE9: length 32.6
  Top Layer w0.254: U6.4 59.69,35.05 58.55,36.2 43.82,36.2 42.79,35.16 39.27,35.16 36.68,32.58 36.68,27.3 U1.40
PE10: length 17.5
  Top Layer w0.254: U1.41 36.23,27.56 36.23,32.81 39.03,35.61 42.6,35.61 H1.12
PE11: length 15.3
  Top Layer w0.254: H1.11 41.91,37.21 40.77,36.07 38.84,36.07 35.78,33 35.78,27.81 U1.42
PE12: length 12.9
  Top Layer w0.254: H1.10 39.37,37.28 35.32,33.23 35.32,28.06 U1.43
PE13: length 11.6
  Top Layer w0.254: U1.44 34.87,28.32 34.87,35.26 36.83,37.22 H1.9
PE14: length 10.5
  Top Layer w0.254: U1.45 34.41,28.57 34.41,37.34 H1.8
PE15: length 11
  Top Layer w0.254: H1.7 31.69,37.41 31.69,33.73 33.96,31.46 33.96,28.82 U1.46
PF1: length 23.3
  Top Layer w0.254: U1.13 39.12,11.05 54.61,11.05 56.13,9.53 U6.23
PF2: length 24.6
  Top Layer w0.254: U1.19 39.38,15.02 42.17,15.02 44.65,17.5 54.63,17.5 56.26,15.88 58.42,15.88 U6.20
PF9: length 25.8
  Top Layer w0.254: U6.25 55.37,6.98 54.36,5.97 42.07,5.97 U1.10
PF10: length 27.3
  Top Layer w0.254: U6.26 58.29,8.38 40.37,8.38 U1.11
RESET: length 63.9
  Top Layer w0.254: 36.46,16.78 35.79,17.45 v1(35.79,17.5) ; 36.46,16.78 35.56,15.88 35.56,15.31 36.17,14.7 38.3,12.57 v1(38.48,12.57) ; 36.46,16.78 39.37,19.69 40.01,19.69 42.8,22.48 48.01,22.48 ; v1(20.35,19.4) 20.8,19.4 21.08,19.69 21.53,19.69 27.8,13.41 v1(29.46,13.41)
  Bottom Layer w0.254: v1(29.46,13.41) 30.94,13.41 33.28,15.75 34.42,15.75 37.59,12.57 v1(38.48,12.57) ; 35.07,16.37 35.79,17.1 v1(35.79,17.5) ; v1(20.35,19.4) 20.16,19.4 18.42,21.14 18.42,28.31 16.52,30.21 12.05,30.21 v1(10.92,29.08)
SPI1_CS: length 17.6
  Top Layer w0.254: v1(23.56,11.21) 23.56,11.63 arc(23.53,11.79) 23.56,11.95 23.56,12.06 25.49,13.99
  Bottom Layer w0.254: v1(23.56,11.21) 23.43,11.34 23.27,11.34 arc(23.21,11.34) 23.16,11.35 arc(23.15,11.35) 23.14,11.36 23.14,12.13 15.96,19.3 14.93,19.3 14.07,20.16 v1(13.72,20.16)
SPI1_MISO: length 20.2
  Top Layer w0.254: U1.91 24.91,12 24.91,11.64 23.89,10.62 v1(23.07,10.62)
  Bottom Layer w0.254: v1(23.07,10.62) 22.75,10.94 arc(22.68,10.98) 22.61,11.04 22.61,12.01 15.96,18.67 12.83,18.67 12.45,19.05 v1(12.45,20.16)
SPI1_MOSI: length 28
  Top Layer w0.254: v1(23.3,9.59) 23.66,9.59 25.4,11.33 25.4,11.71 26.56,12.87 U1.92
  Bottom Layer w0.254: v1(9.91,25.3) 9.91,24 11.86,22.05 11.86,18.99 12.64,18.22 15.77,18.22 22.15,11.83 22.15,10.71 23.28,9.59 v1(23.3,9.59)
SPI1_SCK: length 21.4
  Top Layer w0.254: U1.90 24.12,11.91 v1(24.12,11.79)
  Bottom Layer w0.254: v1(24.12,11.79) 14.74,21.17 14.74,21.47 11.18,25.03 v1(11.18,25.3)
SWCLK: length 14.9
  Top Layer w0.254: v1(19.56,18.35) 20.21,17.7 20.72,17.7 U1.77
  Bottom Layer w0.254: v1(19.56,18.35) 16.33,21.58 16.33,27.48 v1(14.73,29.08)
SWDIO: length 13
  Top Layer w0.254: v1(19.33,19.4) 20.17,18.57 20.88,18.57 20.9,18.59
  Bottom Layer w0.254: v1(19.33,19.4) 19.33,19.53 16.79,22.08 16.79,28.23 v1(15.94,29.08)
UART1_RX: length 50.5
  Top Layer w0.254: v1(20.99,23.21) 21.3,23.21 U1.71 ; 6.35,15.47 6.48,15.6 16.66,15.6 17.91,14.35
  Bottom Layer w0.254: v1(20.99,23.21) 20.99,27.02 16.89,31.12 11.69,31.12 v1(9.65,33.15) 6.35,29.85 v1(6.35,15.6)
UART1_TX: length 37
  Top Layer w0.254: v1(20.32,23.88) 21.34,23.88 22.66,22.55 U1.70
  Bottom Layer w0.254: v1(20.32,23.88) 20.32,27.04 16.7,30.66 11.23,30.66 v1(9.65,29.08) 6.98,26.41 6.98,20.19 12.7,14.48
$1N21: length 18.3
  Top Layer w0.254: 36.17,24.67 U1.36
  Top Layer w0.5: v1(40.8,29.18) 36.23,24.62 36.23,24.62
  Bottom Layer w0.5: 37.22,21.22 36.45,22 36.45,23.85 v1(36.05,24.24) 35.79,24.51 33.81,24.51 C6.1 ; C8.1 C7.1 41.85,30.23 v1(40.8,29.18)
$1N29: length 8.2
  Bottom Layer w0.254: X1.3 36.76,10.86 R1.1
$1N30: length 12.1
  Bottom Layer w0.8: X1.4 46.61,11.12 46.61,13.27 47.31,13.97 C11.1 47.92,15.09 50.25,15.09 C10.1 51.31,14.03 51.31,11.12 L2.2

## Copper pours and planes (outline as drawn; the poured copper is in the pictures)
3.3V on Bottom Layer: 21.08,19.69 30.48,29.08 39.87,19.69 40.01,19.69 30.61,10.29 30.35,10.29 21.08,19.56
3.3V on Bottom Layer: 29.42,9.68 29.68,9.68 29.84,6.45 28.66,7.63
3.3V on Bottom Layer: 20.42,11.13 22.54,9.02 23.92,9.02 26.15,11.18 26.15,15.69 28.25,13.59 28.25,13.41 28.07,12.7 27.56,10.41 24.33,8.01 22.45,7.78 20.98,9.22 19.27,10.84 19.3,11.81 19.69,11.81
3.3V on Bottom Layer: 25.53,9.27 25.53,9.4 27.56,11.43 27.56,11.3
3.3V on Bottom Layer: 27.56,11.17 27.56,11.3 27.59,11.34 27.79,9.36 27.81,8.89 27.36,8.44 24.88,8.44 24.85,8.47
GND on Top Layer: -2.92,41.4 64.26,41.4 64.26,-2.16 -2.92,-2.16
GND on Bottom Layer: -2.92,41.4 64.26,41.4 64.26,-2.16 -2.92,-2.16

## Text on the board
Top Silkscreen Layer: 2026 MAZE | Song Seong Hyuk | B15 B14 B13 B12 B11 B10 E15 E14 E13 E12 E11 E10 | 5V 5V / D9 D8 / D11 D10 / D13 D12 / D15 D14 / C7 C6 / 3(SDA/SCL) / A11 A8 / A15 A12 / C11 C10 / D0 C12 / D2 D1 / D4 D3 / D6 D5 / DG DG | AG AG / E8 E9 / B2 E7 / 1.15 1.12 / 2.5 2.11 / 2.3 2.4 / 2.17 2.13 / 1.3 1.4 / 12.1 12.2 / 12.9 F2 / 12.7 12.8 / F1 12.6 / F9 F10 / C14 C15 / A3.3 D3.3 | B6 B7 B9 E0 E1    E2 E3 E4 E5 E6 C13 | STM32G4 V1.1
